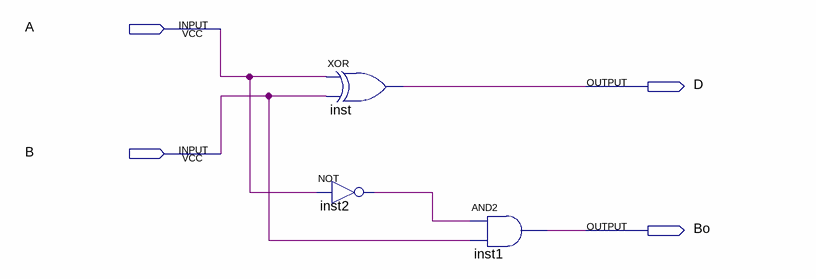
[diagram p0: schematic sheet]
// Quartus schematic HS.bdf as structural Verilog: 3 symbols, 4 pins
module HS (
  input  A,
  input  B,
  output D,
  output Bo
);

  wire inst2_out;

  xor inst (D, A, B);
  not inst2 (inst2_out, A);
  and inst1 (Bo, inst2_out, B);
endmodule
